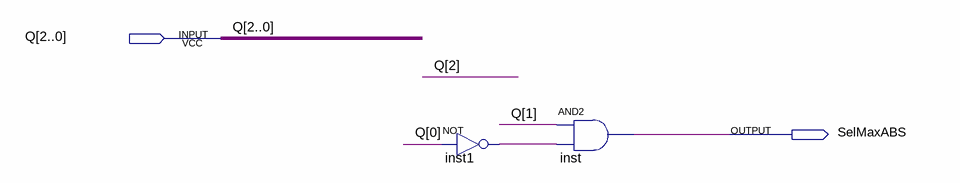
[diagram p0: schematic sheet]
// Quartus schematic Ctrl_Max_ABS.bdf as structural Verilog: 2 symbols, 2 pins
module Ctrl_Max_ABS (
  input  [2:0] Q,
  output SelMaxABS
);

  wire inst1_out;

  not inst1 (inst1_out, Q[0]);
  and inst (SelMaxABS, Q[1], inst1_out);
endmodule
